# Altium project bga_fast_v2.0.PrjPcb (part 1 of 2)
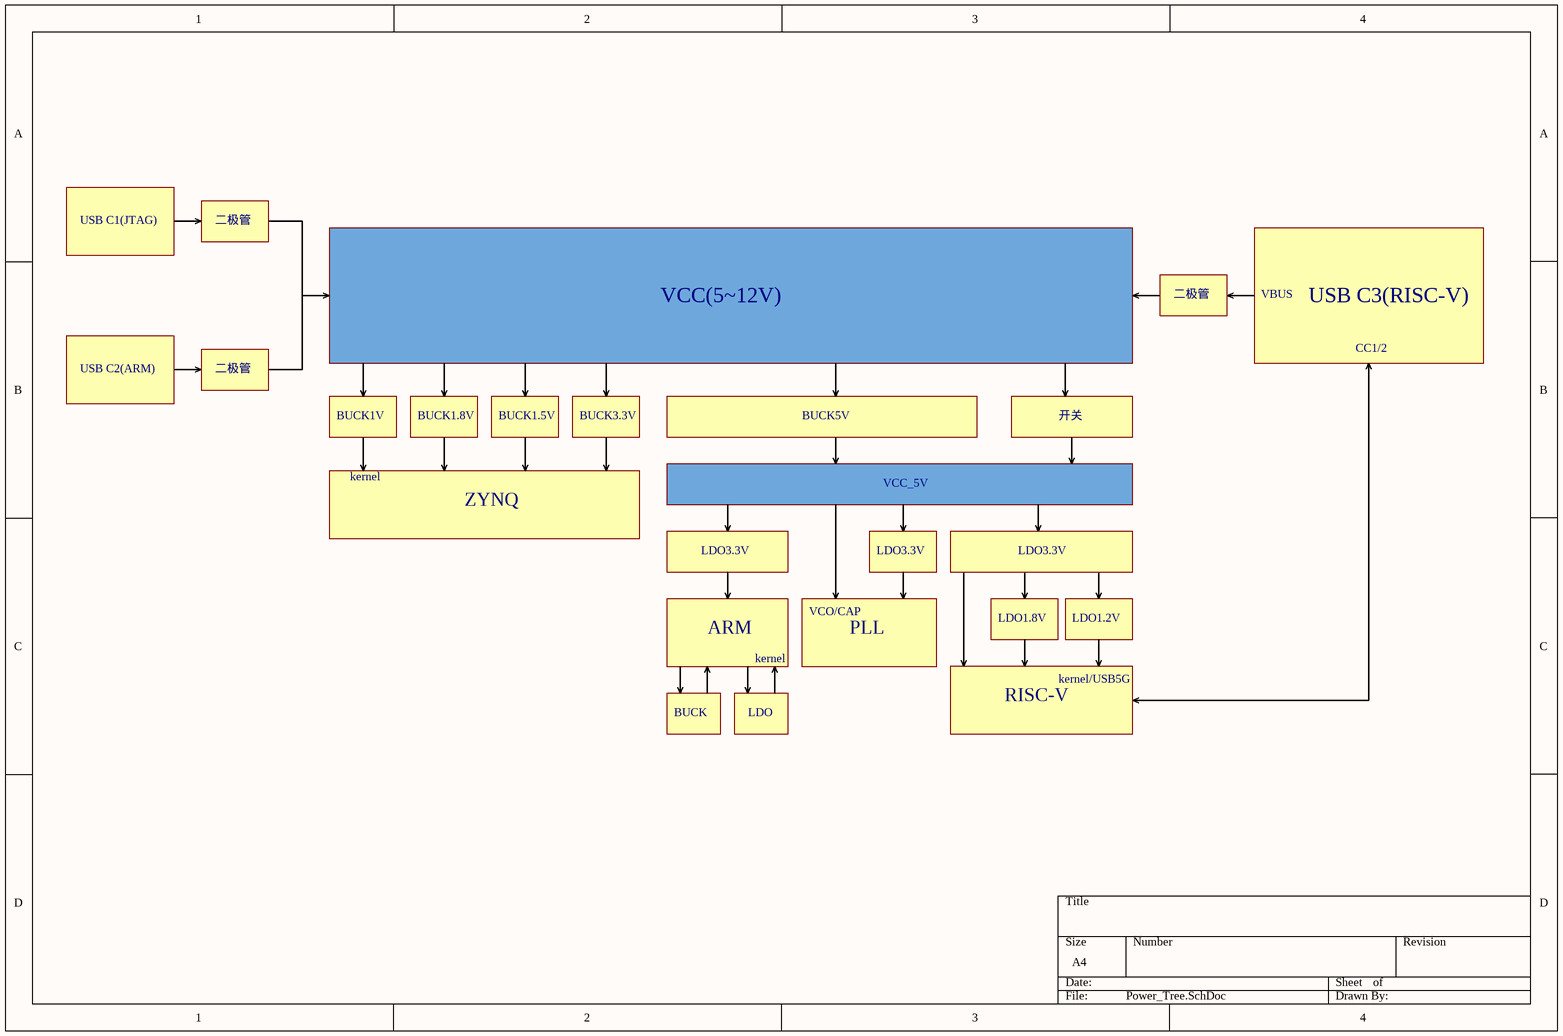
[diagram p0: Power_Tree.SchDoc]
7 sheets, 369 parts. Net scope: global (net labels, ports and power ports of the same name join across sheets).
Board file: BGA_faser_v2.PcbDoc
Sheets:
  Power_Tree.SchDoc
  Cortex_M.SchDoc
  ZYNQ.SchDoc
  jtag.SchDoc
  power.SchDoc
  Risc_V.SchDoc
  AD9156.SchDoc

## Sheet Power_Tree.SchDoc
size A4; SheetNumber: 1; SheetTotal: 7

### Notes on the sheet
- USB C1(JTAG)
- 二极管
- VCC(5~12V)
- VBUS
- USB C3(RISC-V)
- USB C2(ARM)
- CC1/2
- BUCK1V
- BUCK1.8V
- BUCK1.5V
- BUCK3.3V
- BUCK5V
- 开关
- kernel
- ZYNQ
- VCC_5V
- LDO3.3V
- ARM
- VCO/CAP
- PLL
- LDO1.8V
- LDO1.2V
- BUCK
- LDO
- RISC-V
- kernel/USB5G

## Sheet Cortex_M.SchDoc
size A4; SheetNumber: 2; SheetTotal: 7
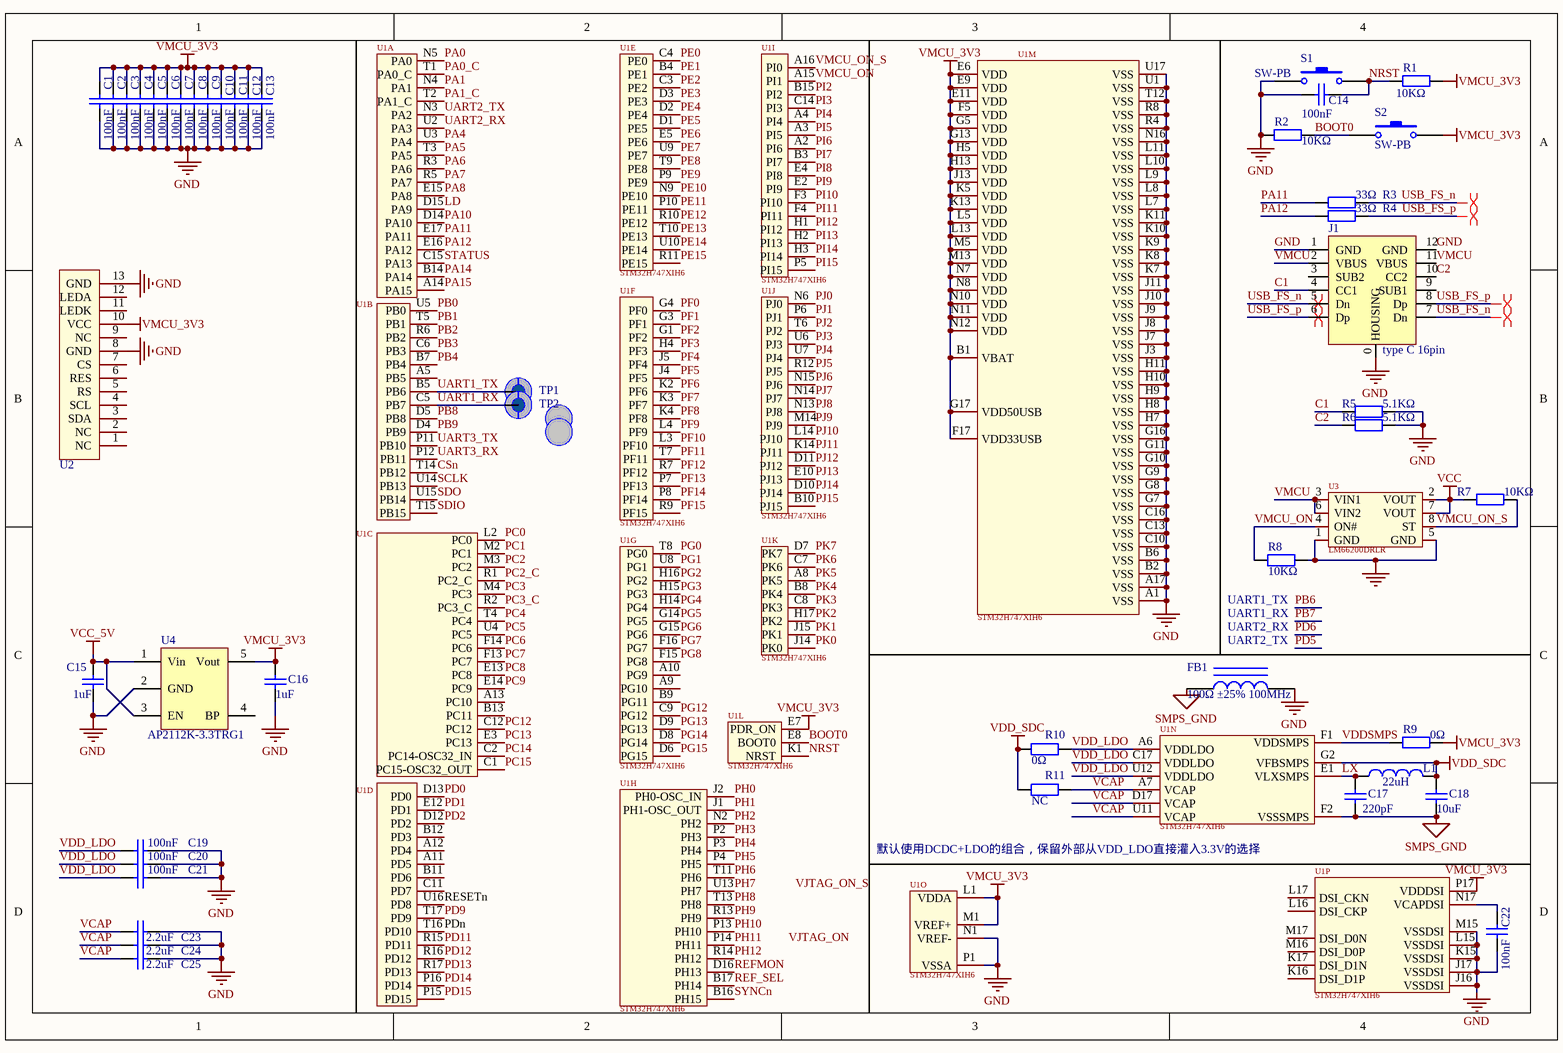
[diagram p1: Cortex_M.SchDoc]

### Parts
(Parts that share a designator on the sheet are numbered #1, #2 ... from top to bottom, then left to right.)
C1  100nF  [0201]
C2  100nF  [0201]
C3  100nF  [0201]
C4  100nF  [0201]
C5  100nF  [0201]
C6  100nF  [0201]
C7  100nF  [0201]
C8  100nF  [0201]
C9  100nF  [0201]
C10  100nF  [0201]
C11  100nF  [0201]
C12  100nF  [0201]
C13  100nF  [0201]
C14  100nF  [0805_C]
C15  1uF  [0805_C]
C16  1uF  [0805_C]
C17  220pF  [0805_C]
C18  10uF  [0805_C]
C19  100nF  [0201]
C20  100nF  [0201]
C21  100nF  [0201]
C22  100nF  [0201]
C23  2.2uF  [0805_C]
C24  2.2uF  [0805_C]
C25  2.2uF  [0805_C]
FB1  100Ω ±25% 100MHz  [0805_L]
J1  type C 16pin  [USB type C  16pin]
L1  value 22uH  [IND-SMD_L2.5-W2.0_YXMBL252010P]  (hidden comment: Inductor)
R1  10KΩ  [0805_R]
R2  10KΩ  [0805_R]
R3  33Ω  [0402_R]
R4  33Ω  [0402_R]
R5  5.1KΩ  [0805_R]
R6  5.1KΩ  [0805_R]
R7  10KΩ  [0805_R]
R8  10KΩ  [0805_R]
R9  0Ω  [0402_R]
R10  0Ω  [0402_R]
R11  NC  [0402_R]
S1  SW-PB  [SW-3*4-2P]
S2  SW-PB  [SW-3*4-2P]
TP1  test-point  [POINT]  (value not drawn)
TP2  test-point  [POINT]  (value not drawn)
U1#1  STM32H747XIH6  [TFBGA-265_L14.0-W14.0-P0.80-TL_STM32H743XIH6]  (value not drawn)  (parts A,B,C,D,E,F,G,H,I,J,K of 13)
U1#2  STM32H747XIH6  [TFBGA-265_L14.0-W14.0-P0.80-TL_STM32H743XIH6]  (parts L,M,N,O,P of 16)
U2  ZJY_1.14  [ZJY_1.14'']  (value not drawn)
U3  LM66200DRLR  [SOT-583-8_L2.1-W1.2-P0.50-LS1.6-BL]
U4  AP2112K-3.3TRG1  [SOT-23-5]

### Nets
GND: C1.1 C2.1 C3.1 C4.1 C5.1 C6.1 C7.1 C8.1 C9.1 C10.1 C11.1 C12.1 C13.1 C14.1 C15.1 C16.1 C19.2 C20.2 C21.2 C22.1 C23.2 C24.2 C25.2 FB1.2 J1.0(HOUSING) J1.1(GND) J1.12(GND) R2.1 R5.2 R6.2 R8.1 S1.1 U1#2.A1(VSS) U1#2.A17(VSS) U1#2.B2(VSS) U1#2.B6(VSS) U1#2.C10(VSS) U1#2.C13(VSS) U1#2.C16(VSS) U1#2.G7(VSS) U1#2.G8(VSS) U1#2.G9(VSS) U1#2.G10(VSS) U1#2.G11(VSS) U1#2.G16(VSS) U1#2.H7(VSS) U1#2.H8(VSS) U1#2.H9(VSS) U1#2.H10(VSS) U1#2.H11(VSS) U1#2.J3(VSS) U1#2.J7(VSS) U1#2.J8(VSS) U1#2.J9(VSS) U1#2.J10(VSS) U1#2.J11(VSS) U1#2.J16(VSSDSI) U1#2.J17(VSSDSI) U1#2.K7(VSS) U1#2.K8(VSS) U1#2.K9(VSS) U1#2.K10(VSS) U1#2.K11(VSS) U1#2.K15(VSSDSI) U1#2.L7(VSS) U1#2.L8(VSS) U1#2.L9(VSS) U1#2.L10(VSS) U1#2.L11(VSS) U1#2.L15(VSSDSI) U1#2.M15(VSSDSI) U1#2.N1(VREF-) U1#2.N16(VSS) U1#2.P1(VSSA) U1#2.R4(VSS) U1#2.R8(VSS) U1#2.T12(VSS) U1#2.U1(VSS) U1#2.U17(VSS) U2.8(GND) U2.13(GND) U3.1(GND) U3.5(GND) U4.2(GND)
SMPS_GND: C17.1 C18.1 FB1.1 U1#2.F2(VSSSMPS)
VCC: R7.1 U3.2(VOUT) U3.7(VOUT)
VCC_5V: C15.2 U4.1(Vin) U4.3(EN)
VDD_SDC: C18.2 L1.2 R10.2 R11.2 U1#2.G2(VFBSMPS)
VMCU_3V3: C1.2 C2.2 C3.2 C4.2 C5.2 C6.2 C7.2 C8.2 C9.2 C10.2 C11.2 C12.2 C13.2 C16.2 R1.2 R9.1 S2.2 U1#2.B1(VBAT) U1#2.E6(VDD) U1#2.E7(PDR_ON) U1#2.E9(VDD) U1#2.E11(VDD) U1#2.F5(VDD) U1#2.F17(VDD33USB) U1#2.G5(VDD) U1#2.G13(VDD) U1#2.G17(VDD50USB) U1#2.H5(VDD) U1#2.H13(VDD) U1#2.J13(VDD) U1#2.K5(VDD) U1#2.K13(VDD) U1#2.L1(VDDA) U1#2.L5(VDD) U1#2.L13(VDD) U1#2.M1(VREF+) U1#2.M5(VDD) U1#2.M13(VDD) U1#2.N7(VDD) U1#2.N8(VDD) U1#2.N10(VDD) U1#2.N11(VDD) U1#2.N12(VDD) U1#2.P17(VDDDSI) U2.10(VCC) U4.5(Vout)
BOOT0: R2.2 S2.1 U1#2.E8(BOOT0)
C1: J1.4(CC1) R5.1
C2: J1.10(CC2) R6.1
CSn: U1#1.T14(PB12)
LD: U1#1.D15(PA9)
LX: C17.2 L1.1 U1#2.E1(VLXSMPS)
NRST: C14.2 R1.1 S1.2 U1#2.K1(NRST)
PA0: U1#1.N5(PA0)
PA0_C: U1#1.T1(PA0_C)
PA1: U1#1.N4(PA1)
PA1_C: U1#1.T2(PA1_C)
PA4: U1#1.U3(PA4)
PA5: U1#1.T3(PA5)
PA6: U1#1.R3(PA6)
PA7: U1#1.R5(PA7)
PA8: U1#1.E15(PA8)
PA10: U1#1.D14(PA10)
PA11: R3.1 U1#1.E17(PA11)
PA12: R4.1 U1#1.E16(PA12)
PA14: U1#1.B14(PA14)
PA15: U1#1.A14(PA15)
PB0: U1#1.U5(PB0)
PB1: U1#1.T5(PB1)
PB2: U1#1.R6(PB2)
PB3: U1#1.C6(PB3)
PB4: U1#1.B7(PB4)
PB8: U1#1.D5(PB8)
PB9: U1#1.D4(PB9)
PC0: U1#1.L2(PC0)
PC1: U1#1.M2(PC1)
PC2: U1#1.M3(PC2)
PC2_C: U1#1.R1(PC2_C)
PC3: U1#1.M4(PC3)
PC3_C: U1#1.R2(PC3_C)
PC4: U1#1.T4(PC4)
PC5: U1#1.U4(PC5)
PC6: U1#1.F14(PC6)
PC7: U1#1.F13(PC7)
PC8: U1#1.E13(PC8)
PC9: U1#1.E14(PC9)
PC12: U1#1.C12(PC12)
PC13: U1#1.E3(PC13)
PC14: U1#1.C2(PC14-OSC32_IN)
PC15: U1#1.C1(PC15-OSC32_OUT)
PD0: U1#1.D13(PD0)
PD1: U1#1.E12(PD1)
PD2: U1#1.D12(PD2)
PD9: U1#1.T17(PD9)
PD11: U1#1.R15(PD11)
PD12: U1#1.R16(PD12)
PD13: U1#1.R17(PD13)
PD14: U1#1.P16(PD14)
PD15: U1#1.P15(PD15)
PDn: U1#1.T16(PD10)
PE0: U1#1.C4(PE0)
PE1: U1#1.B4(PE1)
PE2: U1#1.C3(PE2)
PE3: U1#1.D3(PE3)
PE4: U1#1.D2(PE4)
PE5: U1#1.D1(PE5)
PE6: U1#1.E5(PE6)
PE7: U1#1.U9(PE7)
PE8: U1#1.T9(PE8)
PE9: U1#1.P9(PE9)
PE10: U1#1.N9(PE10)
PE11: U1#1.P10(PE11)
PE12: U1#1.R10(PE12)
PE13: U1#1.T10(PE13)
PE14: U1#1.U10(PE14)
PE15: U1#1.R11(PE15)
PF0: U1#1.G4(PF0)
PF1: U1#1.G3(PF1)
PF2: U1#1.G1(PF2)
PF3: U1#1.H4(PF3)
PF4: U1#1.J5(PF4)
PF5: U1#1.J4(PF5)
PF6: U1#1.K2(PF6)
PF7: U1#1.K3(PF7)
PF8: U1#1.K4(PF8)
PF9: U1#1.L4(PF9)
PF10: U1#1.L3(PF10)
PF11: U1#1.T7(PF11)
PF12: U1#1.R7(PF12)
PF13: U1#1.P7(PF13)
PF14: U1#1.P8(PF14)
PF15: U1#1.R9(PF15)
PG0: U1#1.T8(PG0)
PG1: U1#1.U8(PG1)
PG2: U1#1.H16(PG2)
PG3: U1#1.H15(PG3)
PG4: U1#1.H14(PG4)
PG5: U1#1.G14(PG5)
PG6: U1#1.G15(PG6)
PG7: U1#1.F16(PG7)
PG8: U1#1.F15(PG8)
PG12: U1#1.C9(PG12)
PG13: U1#1.D9(PG13)
PG14: U1#1.D8(PG14)
PG15: U1#1.D6(PG15)
PH0: U1#1.J2(PH0-OSC_IN)
PH1: U1#1.J1(PH1-OSC_OUT)
PH2: U1#1.N2(PH2)
PH3: U1#1.P2(PH3)
PH4: U1#1.P3(PH4)
PH5: U1#1.P4(PH5)
PH6: U1#1.T11(PH6)
PH7: U1#1.U13(PH7)
PH8: U1#1.T13(PH8)
PH9: U1#1.R13(PH9)
PH10: U1#1.P13(PH10)
PH11: U1#1.P14(PH11)
PH12: U1#1.R14(PH12)
PI2: U1#1.B15(PI2)
PI3: U1#1.C14(PI3)
PI4: U1#1.A4(PI4)
PI5: U1#1.A3(PI5)
PI6: U1#1.A2(PI6)
PI7: U1#1.B3(PI7)
PI8: U1#1.E4(PI8)
PI9: U1#1.E2(PI9)
PI10: U1#1.F3(PI10)
PI11: U1#1.F4(PI11)
PI12: U1#1.H1(PI12)
PI13: U1#1.H2(PI13)
PI14: U1#1.H3(PI14)
PI15: U1#1.P5(PI15)
PJ0: U1#1.N6(PJ0)
PJ1: U1#1.P6(PJ1)
PJ2: U1#1.T6(PJ2)
PJ3: U1#1.U6(PJ3)
PJ4: U1#1.U7(PJ4)
PJ5: U1#1.R12(PJ5)
PJ6: U1#1.N15(PJ6)
PJ7: U1#1.N14(PJ7)
PJ8: U1#1.N13(PJ8)
PJ9: U1#1.M14(PJ9)
PJ10: U1#1.L14(PJ10)
PJ11: U1#1.K14(PJ11)
PJ12: U1#1.D11(PJ12)
PJ13: U1#1.E10(PJ13)
PJ14: U1#1.D10(PJ14)
PJ15: U1#1.B10(PJ15)
PK0: U1#1.J14(PK0)
PK1: U1#1.J15(PK1)
PK2: U1#1.H17(PK2)
PK3: U1#1.C8(PK3)
PK4: U1#1.B8(PK4)
PK5: U1#1.A8(PK5)
PK6: U1#1.C7(PK6)
PK7: U1#1.D7(PK7)
REF_SEL: U1#1.B17(PH14)
REFMON: U1#1.D16(PH13)
RESETn: U1#1.U16(PD8)
SCLK: U1#1.U14(PB13)
SDIO: U1#1.T15(PB15)
SDO: U1#1.U15(PB14)
STATUS: U1#1.C15(PA13)
SYNCn: U1#1.B16(PH15)
UART1_RX: TP2.1(point) U1#1.C5(PB7)
UART1_TX: TP1.1(point) U1#1.B5(PB6)
UART2_RX: U1#1.U2(PA3)  [project net U8_TX]
UART2_TX: U1#1.N3(PA2)  [project net U8_RX]
UART3_RX: U1#1.P12(PB11)  [project net U5_TX]
UART3_TX: U1#1.P11(PB10)  [project net U5_RX]
USB_FS_n: J1.5(Dn) J1.7(Dn) R3.2
USB_FS_p: J1.6(Dp) J1.8(Dp) R4.2
VCAP: C23.1 C24.1 C25.1 R11.1 U1#2.A7(VCAP) U1#2.D17(VCAP) U1#2.U11(VCAP)
VDD_LDO: C19.1 C20.1 C21.1 R10.1 U1#2.A6(VDDLDO) U1#2.C17(VDDLDO) U1#2.U12(VDDLDO)
VDDSMPS: R9.2 U1#2.F1(VDDSMPS)
VMCU: J1.2(VBUS) J1.11(VBUS) U3.3(VIN1) U3.6(VIN2)
VMCU_ON: R8.2 U1#1.A15(PI1) U3.4(ON#)
VMCU_ON_S: R7.2 U1#1.A16(PI0) U3.8(ST)
NetC22_2: C22.2 U1#2.N17(VCAPDSI)

Not connected (* = marked no-connect by the designer): J1 3(SUB2) 9(SUB1); U1#1 A5(PB5) A9(PG10) A10(PG9) A11(PD5) A12(PD4) A13(PC10) B9(PG11) B11(PD6) B12(PD3) B13(PC11) C11(PD7); U1#2 K16(DSI_D1P) K17(DSI_D1N) L16(DSI_CKP) L17(DSI_CKN) M16(DSI_D0P) M17(DSI_D0N); U2 1(NC) 2(NC) 3(SDA) 4(SCL) 5(RS) 6(RES) 7(CS) 9(NC) 11(LEDK) 12(LEDA); U4 4(BP)

### Layout directives
differential pair: USB_FS_n, USB_FS_p

### Notes on the sheet
- (near R8) UART1_TX
- UART1_RX
- (near FB1) UART2_TX
- UART2_RX
- (near U1#2) 默认使用DCDC+LDO的组合，保留外部从VDD_LDO直接灌入3.3V的选择
- Labels drawn without touching a wire or pin: VJTAG_ON, VJTAG_ON_S

### Library data of the parts
C1-C14 C19-C22 = 0402 100nF (104) 10% 16V: 贴片电容; ComponentLink1Description: 供应商链接; ComponentLink1URL: http://www.szlcsc.com/product/details_1877.html; Package: 0402; Supplier: LC; SuppliersPartNumber: C1525
C15 C16 = 0805 1uF (105) 10% 50V: 贴片电容; ComponentLink1Description: 供应商链接; ComponentLink1URL: http://www.szlcsc.com/product/details_29074.html; Package: 0805; Supplier: LC; SuppliersPartNumber: C28323
C17 = 0402 220pF (221) 10% 50V: 贴片电容; ComponentLink1Description: 供应商链接; ComponentLink1URL: http://www.szlcsc.com/product/details_1882.html; Package: 0402; Supplier: LC; SuppliersPartNumber: C1530
C18 = 0603 10uF (106) 10% 10V: 贴片电容; ComponentLink1Description: 供应商链接; ComponentLink1URL: http://www.szlcsc.com/product/details_20411.html; Package: 0603; Supplier: LC; SuppliersPartNumber: C19702
C23-C25 = 0402 1.0uF (105) 10% 25V: 贴片电容; ComponentLink1Description: 供应商链接; ComponentLink1URL: http://www.szlcsc.com/product/details_53938.html; Package: 0402; Supplier: LC; SuppliersPartNumber: C52923
FB1 = 0805 100Ω 25% 100MHz: 贴片磁珠; ComponentLink1Description: 供应商链接; ComponentLink1URL: http://www.szlcsc.com/product/details_1367.html; Package: 0805; Supplier: LC; SuppliersPartNumber: C1015
J1 = USB type C 16pin: 16针脚C口
L1 = Inductor: Code_IEC: 1005; Published: 8-Jun-2000; LatestRevisionDate: 29-May-2009; LatestRevisionNote: IPC-7351 Footprint Added.; PackageReference: 0402-A; Publisher: Altium Limited; PackageDescription: Chip Inductor; Code_JEITA: 0402
R1 R2 = 0402 10KΩ (1002) 1%: 贴片电阻; ComponentLink1Description: 供应商链接; ComponentLink1URL: http://www.szlcsc.com/product/details_26487.html; Package: 0402; Supplier: LC; SuppliersPartNumber: C25744
R3 R4 = 0402 33Ω (33R0) 1%: 贴片电阻; ComponentLink1Description: 供应商链接; ComponentLink1URL: http://www.szlcsc.com/product/details_25848.html; Package: 0402; Supplier: LC; SuppliersPartNumber: C25105
R5 R6 = 0402 5.1KΩ (5101) 1%: 贴片电阻; ComponentLink1Description: 供应商链接; ComponentLink1URL: http://www.szlcsc.com/product/details_26648.html; Package: 0402; Supplier: LC; SuppliersPartNumber: C25905
R7 R8 = 0805 10KΩ (1002) 1%: 贴片电阻; ComponentLink1Description: 供应商链接; ComponentLink1URL: http://www.szlcsc.com/product/details_18102.html; Package: 0805; Supplier: LC; SuppliersPartNumber: C17414
R9-R11 = 0402 0Ω (0R0) 1%: 贴片电阻; ComponentLink1Description: 供应商链接; ComponentLink1URL: http://www.szlcsc.com/product/details_17853.html; Package: 0402; Supplier: LC; SuppliersPartNumber: C17168
S1 S2 = SW-PB: Switch; Published: 24-Mar-1999; LatestRevisionDate: 17-Jul-2002; LatestRevisionNote: Re-released for DXP Platform.; PackageReference: SPST-2; Publisher: Altium Limited; PackageDescription: Switch; 2 Leads
TP1 TP2 = test-point: 测试点
U1#1 U1#2 = STM32H747XIH6: 双核MCU; Manufacturer: ST(意法半导体); Add into BOM: yes; Symbol: STM32H747XIH6; Device: STM32H747XIH6; LCSC Part Name: 带DSP和DP-FPU的高性能ARM Cortex-M7 + Cortex-M4 MCU，具有2 MB Flash、1 MB RAM、480 MHz CPU、ART加速器、一级缓存、外部存储器接口、大量外设、SMPS和MIPI-DSI; Supplier Part: C5271089; Manufacturer Part: STM32H747XIH6; Supplier Footprint: TFBGA-265(14x14); JLCPCB Part Class: Extended Part; Datasheet: https://atta.szlcsc.com/upload/public/pdf/source/20230906/B22899485390F262A37AA3B845B2D1AE.pdf; Supplier: LCSC; Convert to PCB: yes
U2 = ZJY_1.14: Convert to PCB: yes; Symbol: ZJY_1.14''; Device: ZJY_1.14; Add into BOM: yes
U3 = LM66200DRLR: 理想二极管; Manufacturer: TI(德州仪器); Add into BOM: yes; Symbol: LM66200DRLR; Device: LM66200DRLR; LCSC Part Name: LM66200DRLR; Supplier Part: C3235556; Manufacturer Part: LM66200DRLR; Supplier Footprint: SOT-583; JLCPCB Part Class: Extended Part; Datasheet: https://www.ti.com/cn/lit/gpn/lm66200; Supplier: LCSC; Convert to PCB: yes
U4 = RT9193-33: 3.3v低压差稳压芯片

## Sheet ZYNQ.SchDoc
size A2; SheetNumber: 3; SheetTotal: 7; SPICEModelCacheBIOPMTWN: <root> / <DocumentId>BIOPMTWN</DocumentId> / <CacheFrame Number="0"> / <Model Name="dpsw2" Kind="CKT"> / <Text>* DIP switch 2 / * jjt 19/6/2002: created / * / *             Switch connections: / *             sw1 / *             |  |  sw2 / *             |  |  |  | / *             |  |  |  | / .subckt dpsw2 1  2  4  5 / + PARAMS: STATE1=0 STATE2=0 RON=1m ROFF=100E6 / * / V1 3 0 {STATE1} / V2 6 0 {STATE2} / * / SDIP1 1 2 3 0 DIPMOD / SDIP2 4 5 6 0 DIPMOD / * / .MODEL DIPMOD SW(VT=0.5 RON={RON} ROFF={ROFF}) / .ends dpsw2</Text> / </Model> / </CacheFrame> / </root>
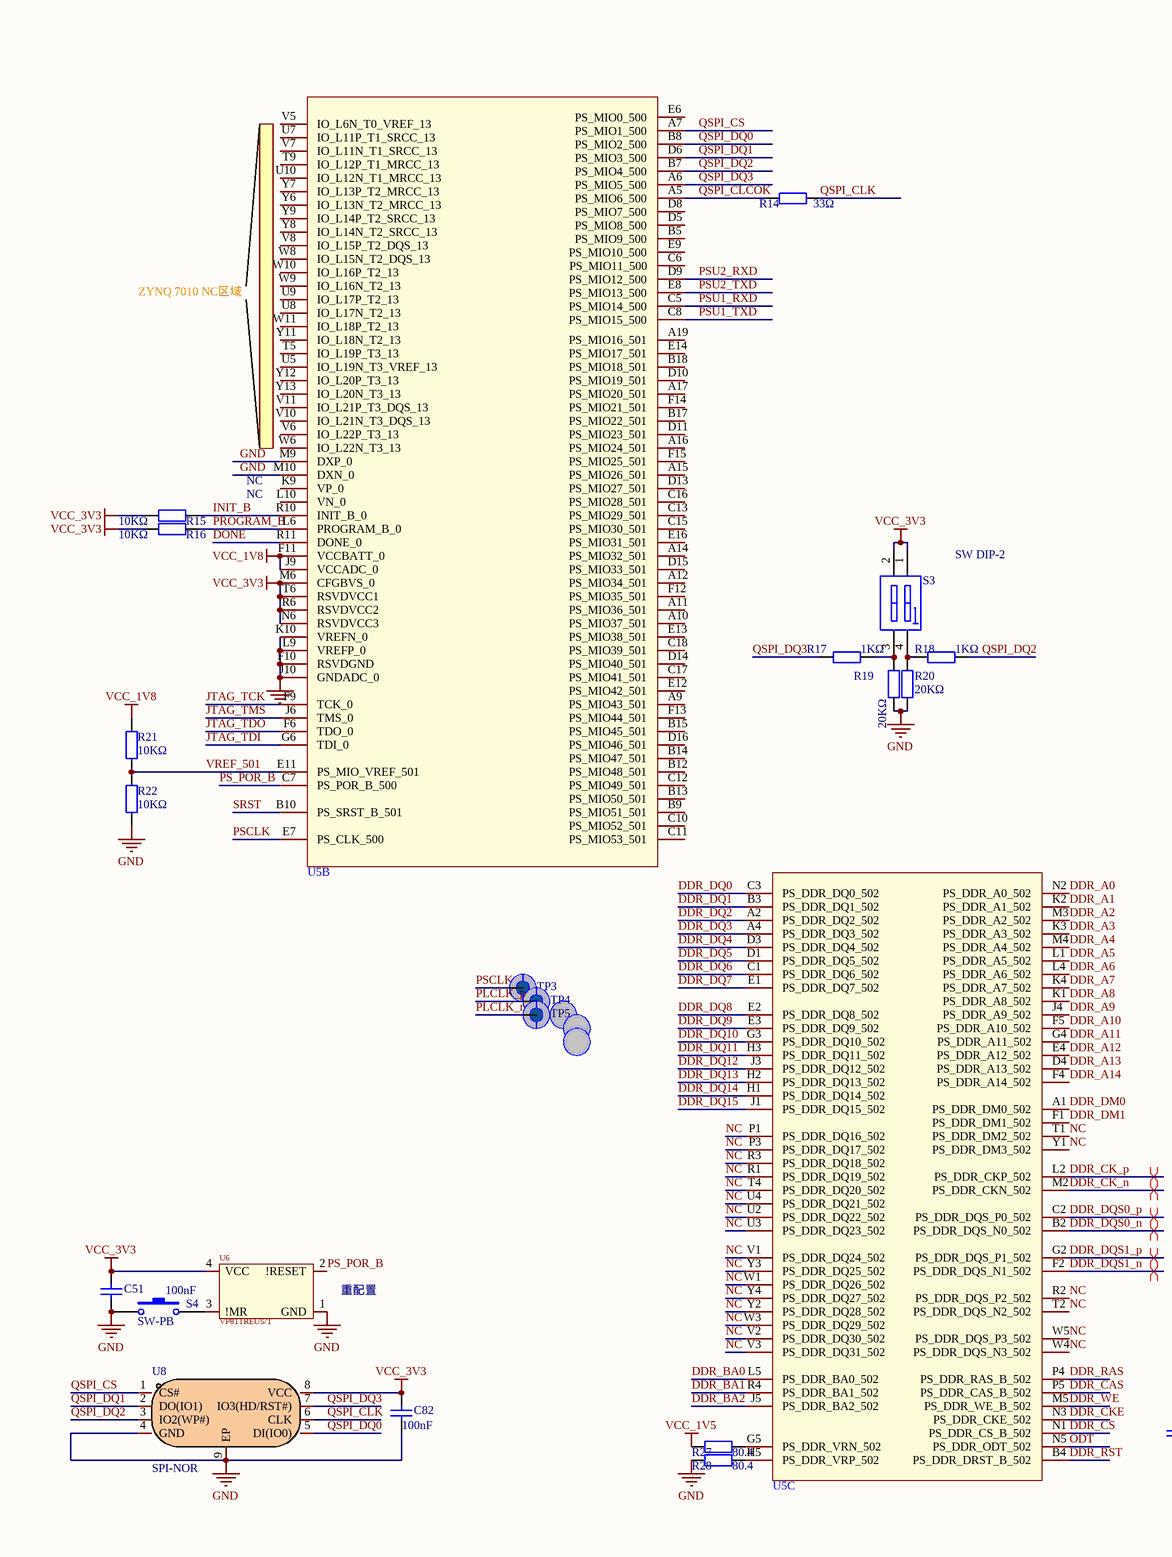
[diagram p2: ZYNQ.SchDoc, left]
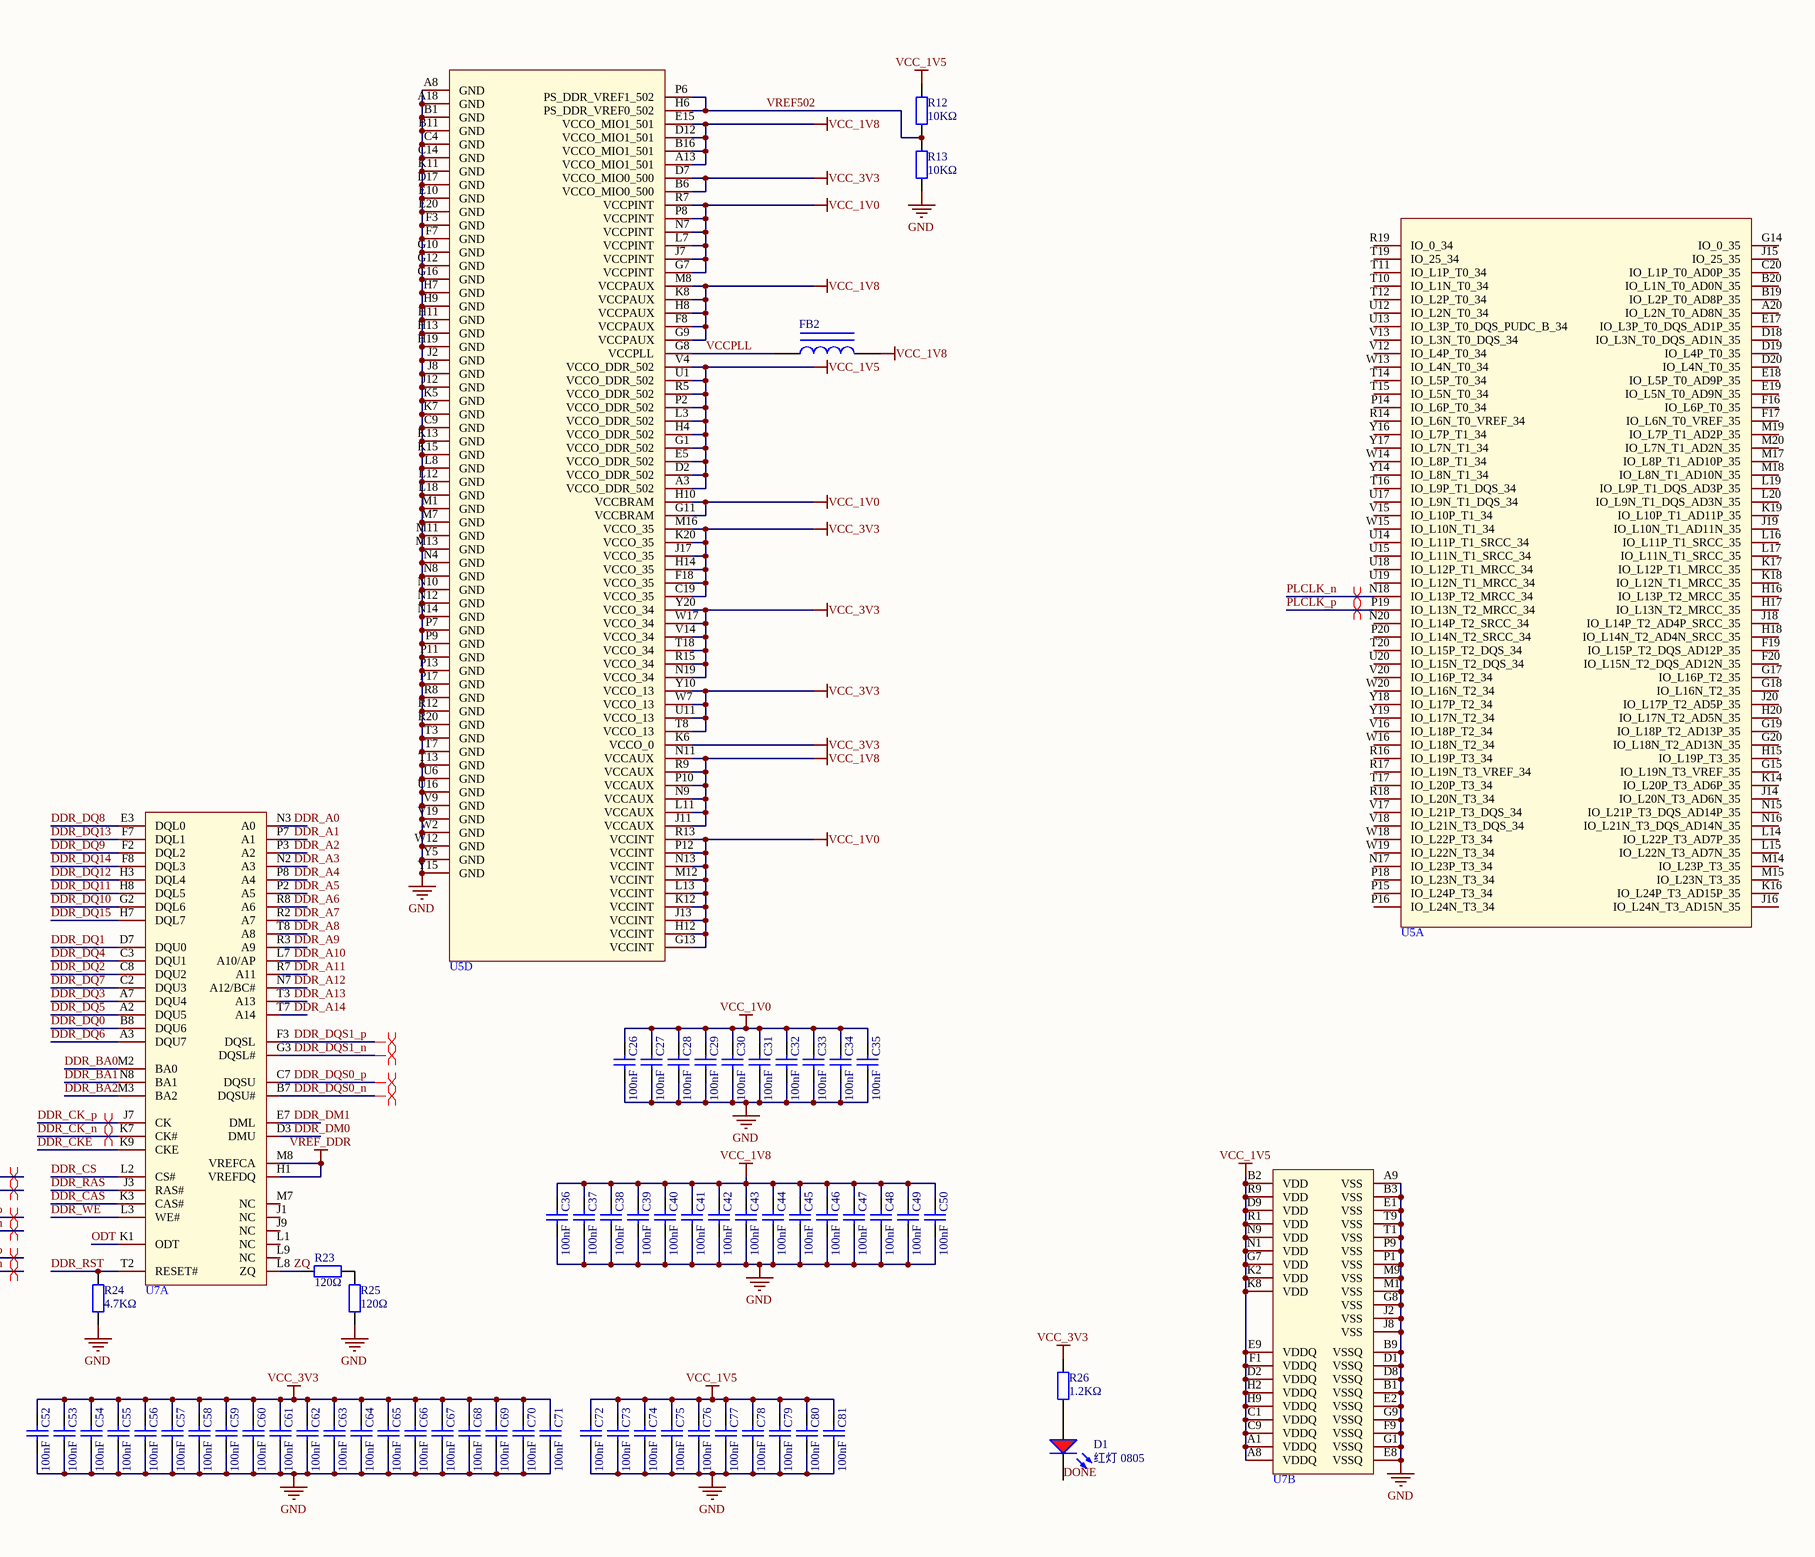
[diagram p3: ZYNQ.SchDoc, right]

### Parts
C26  100nF  [0201]
C27  100nF  [0201]
C28  100nF  [0201]
C29  100nF  [0201]
C30  100nF  [0201]
C31  100nF  [0201]
C32  100nF  [0201]
C33  100nF  [0201]
C34  100nF  [0201]
C35  100nF  [0201]
C36  100nF  [0201]
C37  100nF  [0201]
C38  100nF  [0201]
C39  100nF  [0201]
C40  100nF  [0201]
C41  100nF  [0201]
C42  100nF  [0201]
C43  100nF  [0201]
C44  100nF  [0201]
C45  100nF  [0201]
C46  100nF  [0201]
C47  100nF  [0201]
C48  100nF  [0201]
C49  100nF  [0201]
C50  100nF  [0201]
C51  100nF  [0805_C]
C52  100nF  [0201]
C53  100nF  [0201]
C54  100nF  [0201]
C55  100nF  [0201]
C56  100nF  [0201]
C57  100nF  [0201]
C58  100nF  [0201]
C59  100nF  [0201]
C60  100nF  [0201]
C61  100nF  [0201]
C62  100nF  [0201]
C63  100nF  [0201]
C64  100nF  [0201]
C65  100nF  [0201]
C66  100nF  [0201]
C67  100nF  [0201]
C68  100nF  [0201]
C69  100nF  [0201]
C70  100nF  [0201]
C71  100nF  [0201]
C72  100nF  [0201]
C73  100nF  [0201]
C74  100nF  [0201]
C75  100nF  [0201]
C76  100nF  [0201]
C77  100nF  [0201]
C78  100nF  [0201]
C79  100nF  [0201]
C80  100nF  [0201]
C81  100nF  [0201]
C82  100nF  [0805_C]
D1  红灯 0805  [0805_LED_S1]
FB2  100Ω ±25% 100MHz  [0805_L]  (value not drawn)
R12  10KΩ  [0201]
R13  10KΩ  [0201]
R14  33Ω  [0805_R]
R15  10KΩ  [0201]
R16  10KΩ  [0201]
R17  1KΩ  [0805_R]
R18  1KΩ  [0805_R]
R19  20KΩ  [0805_R]
R20  20KΩ  [0805_R]
R21  10KΩ  [0201]
R22  10KΩ  [0201]
R23  120Ω  [0805_R]
R24  4.7KΩ  [0805_R]
R25  120Ω  [0805_R]
R26  1.2KΩ  [0805_R]
R27  80.4  [0402_R]
R28  80.4  [0402_R]
S3  SW DIP-2  [SW-SMD_DSHP02TS-S]
S4  SW-PB  [SW-3*4-2P]
TP3  test-point  [POINT]  (value not drawn)
TP4  test-point  [POINT]  (value not drawn)
TP5  test-point  [POINT]  (value not drawn)
U5  XC7Z020-2CLG400I  [FBGA-400_L17.0-W17.0-R20-C20-P0.80-TL]  (value not drawn)  (parts A,B,C,D of 4)
U6  VP811REUS/T  [SOT-143_L2.9-W1.3-P1.92-LS2.3-BL]
U7  NT5CC256M16ER-EK  [TFBGA-96_L13.0-W8.0-R16-C6-P0.80-TL]  (value not drawn)  (parts A,B of 2)
U8  SPI-NOR  [WSON8]

### Nets
GND: C26.1 C27.1 C28.1 C29.1 C30.1 C31.1 C32.1 C33.1 C34.1 C35.1 C36.1 C37.1 C38.1 C39.1 C40.1 C41.1 C42.1 C43.1 C44.1 C45.1 C46.1 C47.1 C48.1 C49.1 C50.1 C51.1 C52.1 C53.1 C54.1 C55.1 C56.1 C57.1 C58.1 C59.1 C60.1 C61.1 C62.1 C63.1 C64.1 C65.1 C66.1 C67.1 C68.1 C69.1 C70.1 C71.1 C72.1 C73.1 C74.1 C75.1 C76.1 C77.1 C78.1 C79.1 C80.1 C81.1 C82.1 R13.1 R19.1 R20.1 R22.1 R24.1 R25.1 R28.1 S4.1 U5.A8(GND) U5.A18(GND) U5.B1(GND) U5.B11(GND) U5.C4(GND) U5.C9(GND) U5.C14(GND) U5.D17(GND) U5.E10(GND) U5.E20(GND) U5.F3(GND) U5.F7(GND) U5.F10(RSVDGND) U5.G10(GND) U5.G12(GND) U5.G16(GND) U5.H7(GND) U5.H9(GND) U5.H11(GND) U5.H13(GND) U5.H19(GND) U5.J2(GND) U5.J8(GND) U5.J10(GNDADC_0) U5.J12(GND) U5.K5(GND) U5.K7(GND) U5.K10(VREFN_0) U5.K11(GND) U5.K13(GND) U5.K15(GND) U5.L8(GND) U5.L9(VREFP_0) U5.L12(GND) U5.L18(GND) U5.M1(GND) U5.M7(GND) U5.M9(DXP_0) U5.M10(DXN_0) U5.M11(GND) U5.M13(GND) U5.N4(GND) U5.N8(GND) U5.N10(GND) U5.N12(GND) U5.N14(GND) U5.P7(GND) U5.P9(GND) U5.P11(GND) U5.P13(GND) U5.P17(GND) U5.R8(GND) U5.R12(GND) U5.R20(GND) U5.T3(GND) U5.T7(GND) U5.T13(GND) U5.U6(GND) U5.U16(GND) U5.V9(GND) U5.V19(GND) U5.W2(GND) U5.W12(GND) U5.Y5(GND) U5.Y15(GND) U6.1(GND) U7.A9(VSS) U7.B1(VSSQ) U7.B3(VSS) U7.B9(VSSQ) U7.D1(VSSQ) U7.D8(VSSQ) U7.E1(VSS) U7.E2(VSSQ) U7.E8(VSSQ) U7.F9(VSSQ) U7.G1(VSSQ) U7.G8(VSS) U7.G9(VSSQ) U7.J2(VSS) U7.J8(VSS) U7.M1(VSS) U7.M9(VSS) U7.P1(VSS) U7.P9(VSS) U7.T1(VSS) U7.T9(VSS) U8.4(GND) U8.9(EP)
VCC_1V0: C26.2 C27.2 C28.2 C29.2 C30.2 C31.2 C32.2 C33.2 C34.2 C35.2 U5.G7(VCCPINT) U5.G11(VCCBRAM) U5.G13(VCCINT) U5.H10(VCCBRAM) U5.H12(VCCINT) U5.J7(VCCPINT) U5.J13(VCCINT) U5.K12(VCCINT) U5.L7(VCCPINT) U5.L13(VCCINT) U5.M12(VCCINT) U5.N7(VCCPINT) U5.N13(VCCINT) U5.P8(VCCPINT) U5.P12(VCCINT) U5.R7(VCCPINT) U5.R13(VCCINT)
VCC_1V5: C72.2 C73.2 C74.2 C75.2 C76.2 C77.2 C78.2 C79.2 C80.2 C81.2 R12.2 R27.1 U5.A3(VCCO_DDR_502) U5.D2(VCCO_DDR_502) U5.E5(VCCO_DDR_502) U5.G1(VCCO_DDR_502) U5.H4(VCCO_DDR_502) U5.L3(VCCO_DDR_502) U5.P2(VCCO_DDR_502) U5.R5(VCCO_DDR_502) U5.U1(VCCO_DDR_502) U5.V4(VCCO_DDR_502) U7.A1(VDDQ) U7.A8(VDDQ) U7.B2(VDD) U7.C1(VDDQ) U7.C9(VDDQ) U7.D2(VDDQ) U7.D9(VDD) U7.E9(VDDQ) U7.F1(VDDQ) U7.G7(VDD) U7.H2(VDDQ) U7.H9(VDDQ) U7.K2(VDD) U7.K8(VDD) U7.N1(VDD) U7.N9(VDD) U7.R1(VDD) U7.R9(VDD)
VCC_1V8: C36.2 C37.2 C38.2 C39.2 C40.2 C41.2 C42.2 C43.2 C44.2 C45.2 C46.2 C47.2 C48.2 C49.2 C50.2 FB2.2 R21.2 U5.A13(VCCO_MIO1_501) U5.B16(VCCO_MIO1_501) U5.D12(VCCO_MIO1_501) U5.E15(VCCO_MIO1_501) U5.F8(VCCPAUX) U5.F11(VCCBATT_0) U5.G9(VCCPAUX) U5.H8(VCCPAUX) U5.J9(VCCADC_0) U5.J11(VCCAUX) U5.K8(VCCPAUX) U5.L11(VCCAUX) U5.M8(VCCPAUX) U5.N9(VCCAUX) U5.N11(VCCAUX) U5.P10(VCCAUX) U5.R9(VCCAUX)
VCC_3V3: C51.2 C52.2 C53.2 C54.2 C55.2 C56.2 C57.2 C58.2 C59.2 C60.2 C61.2 C62.2 C63.2 C64.2 C65.2 C66.2 C67.2 C68.2 C69.2 C70.2 C71.2 C82.2 R15.1 R16.1 R26.2 S3.1(A1) S3.2(A2) U5.B6(VCCO_MIO0_500) U5.C19(VCCO_35) U5.D7(VCCO_MIO0_500) U5.F18(VCCO_35) U5.H14(VCCO_35) U5.J17(VCCO_35) U5.K6(VCCO_0) U5.K20(VCCO_35) U5.M6(CFGBVS_0) U5.M16(VCCO_35) U5.N6(RSVDVCC3) U5.N19(VCCO_34) U5.R6(RSVDVCC2) U5.R15(VCCO_34) U5.T6(RSVDVCC1) U5.T8(VCCO_13) U5.T18(VCCO_34) U5.U11(VCCO_13) U5.V14(VCCO_34) U5.W7(VCCO_13) U5.W17(VCCO_34) U5.Y10(VCCO_13) U5.Y20(VCCO_34) U6.4(VCC) U8.8(VCC)
VREF_DDR: U7.H1(VREFDQ) U7.M8(VREFCA)
DDR_A0: U5.N2(PS_DDR_A0_502) U7.N3(A0)
DDR_A1: U5.K2(PS_DDR_A1_502) U7.P7(A1)
DDR_A2: U5.M3(PS_DDR_A2_502) U7.P3(A2)
DDR_A3: U5.K3(PS_DDR_A3_502) U7.N2(A3)
DDR_A4: U5.M4(PS_DDR_A4_502) U7.P8(A4)
DDR_A5: U5.L1(PS_DDR_A5_502) U7.P2(A5)
DDR_A6: U5.L4(PS_DDR_A6_502) U7.R8(A6)
DDR_A7: U5.K4(PS_DDR_A7_502) U7.R2(A7)
DDR_A8: U5.K1(PS_DDR_A8_502) U7.T8(A8)
DDR_A9: U5.J4(PS_DDR_A9_502) U7.R3(A9)
DDR_A10: U5.F5(PS_DDR_A10_502) U7.L7(A10/AP)
DDR_A11: U5.G4(PS_DDR_A11_502) U7.R7(A11)
DDR_A12: U5.E4(PS_DDR_A12_502) U7.N7(A12/BC#)
DDR_A13: U5.D4(PS_DDR_A13_502) U7.T3(A13)
DDR_A14: U5.F4(PS_DDR_A14_502) U7.T7(A14)
DDR_BA0: U5.L5(PS_DDR_BA0_502) U7.M2(BA0)
DDR_BA1: U5.R4(PS_DDR_BA1_502) U7.N8(BA1)
DDR_BA2: U5.J5(PS_DDR_BA2_502) U7.M3(BA2)
DDR_CAS: U5.P5(PS_DDR_CAS_B_502) U7.K3(CAS#)
DDR_CK_n: U5.M2(PS_DDR_CKN_502) U7.K7(CK#)
DDR_CK_p: U5.L2(PS_DDR_CKP_502) U7.J7(CK)
DDR_CKE: U5.N3(PS_DDR_CKE_502) U7.K9(CKE)
DDR_CS: U5.N1(PS_DDR_CS_B_502) U7.L2(CS#)
DDR_DM0: U5.A1(PS_DDR_DM0_502) U7.D3(DMU)
DDR_DM1: U5.F1(PS_DDR_DM1_502) U7.E7(DML)
DDR_DQ0: U5.C3(PS_DDR_DQ0_502) U7.B8(DQU6)
DDR_DQ1: U5.B3(PS_DDR_DQ1_502) U7.D7(DQU0)
DDR_DQ2: U5.A2(PS_DDR_DQ2_502) U7.C8(DQU2)
DDR_DQ3: U5.A4(PS_DDR_DQ3_502) U7.A7(DQU4)
DDR_DQ4: U5.D3(PS_DDR_DQ4_502) U7.C3(DQU1)
DDR_DQ5: U5.D1(PS_DDR_DQ5_502) U7.A2(DQU5)
DDR_DQ6: U5.C1(PS_DDR_DQ6_502) U7.A3(DQU7)
DDR_DQ7: U5.E1(PS_DDR_DQ7_502) U7.C2(DQU3)
DDR_DQ8: U5.E2(PS_DDR_DQ8_502) U7.E3(DQL0)
DDR_DQ9: U5.E3(PS_DDR_DQ9_502) U7.F2(DQL2)
DDR_DQ10: U5.G3(PS_DDR_DQ10_502) U7.G2(DQL6)
DDR_DQ11: U5.H3(PS_DDR_DQ11_502) U7.H8(DQL5)
DDR_DQ12: U5.J3(PS_DDR_DQ12_502) U7.H3(DQL4)
DDR_DQ13: U5.H2(PS_DDR_DQ13_502) U7.F7(DQL1)
DDR_DQ14: U5.H1(PS_DDR_DQ14_502) U7.F8(DQL3)
DDR_DQ15: U5.J1(PS_DDR_DQ15_502) U7.H7(DQL7)
DDR_DQS0_n: U5.B2(PS_DDR_DQS_N0_502) U7.B7(DQSU#)
DDR_DQS0_p: U5.C2(PS_DDR_DQS_P0_502) U7.C7(DQSU)
DDR_DQS1_n: U5.F2(PS_DDR_DQS_N1_502) U7.G3(DQSL#)
DDR_DQS1_p: U5.G2(PS_DDR_DQS_P1_502) U7.F3(DQSL)
DDR_RAS: U5.P4(PS_DDR_RAS_B_502) U7.J3(RAS#)
DDR_RST: R24.2 U5.B4(PS_DDR_DRST_B_502) U7.T2(RESET#)
DDR_WE: U5.M5(PS_DDR_WE_B_502) U7.L3(WE#)
DONE: D1.K U5.R11(DONE_0)
INIT_B: R15.2 U5.R10(INIT_B_0)
JTAG_TCK: U5.F9(TCK_0)
JTAG_TDI: U5.G6(TDI_0)
JTAG_TDO: U5.F6(TDO_0)
JTAG_TMS: U5.J6(TMS_0)
NC: U5.P1(PS_DDR_DQ16_502) U5.P3(PS_DDR_DQ17_502) U5.R1(PS_DDR_DQ19_502) U5.R2(PS_DDR_DQS_P2_502) U5.R3(PS_DDR_DQ18_502) U5.T1(PS_DDR_DM2_502) U5.T2(PS_DDR_DQS_N2_502) U5.T4(PS_DDR_DQ20_502) U5.U2(PS_DDR_DQ22_502) U5.U3(PS_DDR_DQ23_502) U5.U4(PS_DDR_DQ21_502) U5.V1(PS_DDR_DQ24_502) U5.V2(PS_DDR_DQ30_502) U5.V3(PS_DDR_DQ31_502) U5.W1(PS_DDR_DQ26_502) U5.W3(PS_DDR_DQ29_502) U5.W4(PS_DDR_DQS_N3_502) U5.W5(PS_DDR_DQS_P3_502) U5.Y1(PS_DDR_DM3_502) U5.Y2(PS_DDR_DQ28_502) U5.Y3(PS_DDR_DQ25_502) U5.Y4(PS_DDR_DQ27_502)
ODT: U5.N5(PS_DDR_ODT_502) U7.K1(ODT)
PLCLK_n: TP5.1(point) U5.N18(IO_L13P_T2_MRCC_34)
PLCLK_p: TP4.1(point) U5.P19(IO_L13N_T2_MRCC_34)
PROGRAM_B: R16.2 U5.L6(PROGRAM_B_0)
PS_POR_B: U5.C7(PS_POR_B_500) U6.2(!RESET)
PSCLK: TP3.1(point) U5.E7(PS_CLK_500)
PSU1_RXD: U5.C5(PS_MIO14_500)
PSU1_TXD: U5.C8(PS_MIO15_500)
PSU2_RXD: U5.D9(PS_MIO12_500)
PSU2_TXD: U5.E8(PS_MIO13_500)
QSPI_CLCOK: R14.1 U5.A5(PS_MIO6_500)
QSPI_CLK: R14.2 U8.6(CLK)
QSPI_CS: U5.A7(PS_MIO1_500) U8.1(CS#)
QSPI_DQ0: U5.B8(PS_MIO2_500) U8.5(DI(IO0))
QSPI_DQ1: U5.D6(PS_MIO3_500) U8.2(DO(IO1))
QSPI_DQ2: R18.2 U5.B7(PS_MIO4_500) U8.3(IO2(WP#))
QSPI_DQ3: R17.1 U5.A6(PS_MIO5_500) U8.7(IO3(HD/RST#))
SRST: U5.B10(PS_SRST_B_501)
VCCPLL: FB2.1 U5.G8(VCCPLL)
VREF502: R12.1 R13.2 U5.H6(PS_DDR_VREF0_502) U5.P6(PS_DDR_VREF1_502)
VREF_501: R21.1 R22.2 U5.E11(PS_MIO_VREF_501)
ZQ: R23.1 U7.L8(ZQ)
NetD1_A: D1.A R26.1
NetR17_2: R17.2 R19.2 S3.3(B2)
NetR18_1: R18.1 R20.2 S3.4(B1)
NetR23_2: R23.2 R25.2
NetR27_2: R27.2 U5.G5(PS_DDR_VRN_502)
NetR28_2: R28.2 U5.H5(PS_DDR_VRP_502)
NetS4_2: S4.2 U6.3(!MR)

Not connected (* = marked no-connect by the designer): U5 A9(PS_MIO43_501) A10(PS_MIO37_501) A11(PS_MIO36_501) A12(PS_MIO34_501) A14(PS_MIO32_501) A15(PS_MIO26_501) A16(PS_MIO24_501) A17(PS_MIO20_501) A19(PS_MIO16_501) A20(IO_L2N_T0_AD8N_35) B5(PS_MIO9_500) B9(PS_MIO51_501) B12(PS_MIO48_501) B13(PS_MIO50_501) B14(PS_MIO47_501) B15(PS_MIO45_501) B17(PS_MIO22_501) B18(PS_MIO18_501) B19(IO_L2P_T0_AD8P_35) B20(IO_L1N_T0_AD0N_35) C6(PS_MIO11_500) C10(PS_MIO52_501) C11(PS_MIO53_501) C12(PS_MIO49_501) C13(PS_MIO29_501) C15(PS_MIO30_501) C16(PS_MIO28_501) C17(PS_MIO41_501) C18(PS_MIO39_501) C20(IO_L1P_T0_AD0P_35) D5(PS_MIO8_500) D8(PS_MIO7_500) D10(PS_MIO19_501) D11(PS_MIO23_501) D13(PS_MIO27_501) D14(PS_MIO40_501) D15(PS_MIO33_501) D16(PS_MIO46_501) D18(IO_L3N_T0_DQS_AD1N_35) D19(IO_L4P_T0_35) D20(IO_L4N_T0_35) E6(PS_MIO0_500) E9(PS_MIO10_500) E12(PS_MIO42_501) E13(PS_MIO38_501) E14(PS_MIO17_501) E16(PS_MIO31_501) E17(IO_L3P_T0_DQS_AD1P_35) E18(IO_L5P_T0_AD9P_35) E19(IO_L5N_T0_AD9N_35) F12(PS_MIO35_501) F13(PS_MIO44_501) F14(PS_MIO21_501) F15(PS_MIO25_501) F16(IO_L6P_T0_35) F17(IO_L6N_T0_VREF_35) F19(IO_L15P_T2_DQS_AD12P_35) F20(IO_L15N_T2_DQS_AD12N_35) G14(IO_0_35) G15(IO_L19N_T3_VREF_35) G17(IO_L16P_T2_35) G18(IO_L16N_T2_35) G19(IO_L18P_T2_AD13P_35) G20(IO_L18N_T2_AD13N_35) H15(IO_L19P_T3_35) H16(IO_L13P_T2_MRCC_35) H17(IO_L13N_T2_MRCC_35) H18(IO_L14N_T2_AD4N_SRCC_35) H20(IO_L17N_T2_AD5N_35) J14(IO_L20N_T3_AD6N_35) J15(IO_25_35) J16(IO_L24N_T3_AD15N_35) J18(IO_L14P_T2_AD4P_SRCC_35) J19(IO_L10N_T1_AD11N_35) J20(IO_L17P_T2_AD5P_35) K9(VP_0) K14(IO_L20P_T3_AD6P_35) K16(IO_L24P_T3_AD15P_35) K17(IO_L12P_T1_MRCC_35) K18(IO_L12N_T1_MRCC_35) K19(IO_L10P_T1_AD11P_35) L10(VN_0) L14(IO_L22P_T3_AD7P_35) L15(IO_L22N_T3_AD7N_35) L16(IO_L11P_T1_SRCC_35) L17(IO_L11N_T1_SRCC_35) L19(IO_L9P_T1_DQS_AD3P_35) L20(IO_L9N_T1_DQS_AD3N_35) M14(IO_L23P_T3_35) M15(IO_L23N_T3_35) M17(IO_L8P_T1_AD10P_35) M18(IO_L8N_T1_AD10N_35) M19(IO_L7P_T1_AD2P_35) M20(IO_L7N_T1_AD2N_35) N15(IO_L21P_T3_DQS_AD14P_35) N16(IO_L21N_T3_DQS_AD14N_35) N17(IO_L23P_T3_34) N20(IO_L14P_T2_SRCC_34) P14(IO_L6P_T0_34) P15(IO_L24P_T3_34) P16(IO_L24N_T3_34) P18(IO_L23N_T3_34) P20(IO_L14N_T2_SRCC_34) R14(IO_L6N_T0_VREF_34) R16(IO_L19P_T3_34) R17(IO_L19N_T3_VREF_34) R18(IO_L20N_T3_34) R19(IO_0_34) T5(IO_L19P_T3_13) T9(IO_L12P_T1_MRCC_13) T10(IO_L1N_T0_34) T11(IO_L1P_T0_34) T12(IO_L2P_T0_34) T14(IO_L5P_T0_34) T15(IO_L5N_T0_34) T16(IO_L9P_T1_DQS_34) T17(IO_L20P_T3_34) T19(IO_25_34) T20(IO_L15P_T2_DQS_34) U5(IO_L19N_T3_VREF_13) U7(IO_L11P_T1_SRCC_13) U8(IO_L17N_T2_13) U9(IO_L17P_T2_13) U10(IO_L12N_T1_MRCC_13) U12(IO_L2N_T0_34) U13(IO_L3P_T0_DQS_PUDC_B_34) U14(IO_L11P_T1_SRCC_34) U15(IO_L11N_T1_SRCC_34) U17(IO_L9N_T1_DQS_34) U18(IO_L12P_T1_MRCC_34) U19(IO_L12N_T1_MRCC_34) U20(IO_L15N_T2_DQS_34) V5(IO_L6N_T0_VREF_13) V6(IO_L22P_T3_13) V7(IO_L11N_T1_SRCC_13) V8(IO_L15P_T2_DQS_13) V10(IO_L21N_T3_DQS_13) V11(IO_L21P_T3_DQS_13) V12(IO_L4P_T0_34) V13(IO_L3N_T0_DQS_34) V15(IO_L10P_T1_34) V16(IO_L18P_T2_34) V17(IO_L21P_T3_DQS_34) V18(IO_L21N_T3_DQS_34) V20(IO_L16P_T2_34) W6(IO_L22N_T3_13) W8(IO_L15N_T2_DQS_13) W9(IO_L16N_T2_13) W10(IO_L16P_T2_13) W11(IO_L18P_T2_13) W13(IO_L4N_T0_34) W14(IO_L8P_T1_34) W15(IO_L10N_T1_34) W16(IO_L18N_T2_34) W18(IO_L22P_T3_34) W19(IO_L22N_T3_34) W20(IO_L16N_T2_34) Y6(IO_L13N_T2_MRCC_13) Y7(IO_L13P_T2_MRCC_13) Y8(IO_L14N_T2_SRCC_13) Y9(IO_L14P_T2_SRCC_13) Y11(IO_L18N_T2_13) Y12(IO_L20P_T3_13) Y13(IO_L20N_T3_13) Y14(IO_L8N_T1_34) Y16(IO_L7P_T1_34) Y17(IO_L7N_T1_34) Y18(IO_L17P_T2_34) Y19(IO_L17N_T2_34); U7 J1(NC) J9(NC) L1(NC) L9(NC) M7(NC)

### Layout directives
differential pair: DDR_CK_n, DDR_CK_p, DDR_DQS0_n, DDR_DQS0_p, DDR_DQS1_n, DDR_DQS1_p, PLCLK_n, PLCLK_p

### Notes on the sheet
- ZYNQ 7010 NC区域
- NC
- (near U6) 重配置

### Library data of the parts
C26-C82 = 0402 100nF (104) 10% 16V: 贴片电容; ComponentLink1Description: 供应商链接; ComponentLink1URL: http://www.szlcsc.com/product/details_1877.html; Package: 0402; Supplier: LC; SuppliersPartNumber: C1525
D1 = 0805 红灯: 发光二极管; ComponentLink1Description: 供应商链接; ComponentLink1URL: http://www.szlcsc.com/product/details_2668.html; Package: 0805; Supplier: LC; SuppliersPartNumber: C2295
FB2 = 0805 100Ω 25% 100MHz: 贴片磁珠; ComponentLink1Description: 供应商链接; ComponentLink1URL: http://www.szlcsc.com/product/details_1367.html; Package: 0805; Supplier: LC; SuppliersPartNumber: C1015
R12 R13 R21 R22 = 0805 10KΩ (1002) 1%: 贴片电阻; ComponentLink1Description: 供应商链接; ComponentLink1URL: http://www.szlcsc.com/product/details_18102.html; Package: 0805; Supplier: LC; SuppliersPartNumber: C17414
R14 = 0402 33Ω (33R0) 1%: 贴片电阻; ComponentLink1Description: 供应商链接; ComponentLink1URL: http://www.szlcsc.com/product/details_25848.html; Package: 0402; Supplier: LC; SuppliersPartNumber: C25105
R15 R16 R24 = 0402 4.7KΩ (4701) 1%: 贴片电阻; ComponentLink1Description: 供应商链接; ComponentLink1URL: http://www.szlcsc.com/product/details_26643.html; Package: 0402; Supplier: LC; SuppliersPartNumber: C25900
R17 R18 = 0402 10KΩ (1002) 1%: 贴片电阻; ComponentLink1Description: 供应商链接; ComponentLink1URL: http://www.szlcsc.com/product/details_26487.html; Package: 0402; Supplier: LC; SuppliersPartNumber: C25744
R19 R20 = 0402 20KΩ (2002) 1%: 贴片电阻; ComponentLink1Description: 供应商链接; ComponentLink1URL: http://www.szlcsc.com/product/details_26508.html; Package: 0402; Supplier: LC; SuppliersPartNumber: C25765
R23 R25 = 0402 120Ω (1200) 1%: 贴片电阻; ComponentLink1Description: 供应商链接; ComponentLink1URL: http://www.szlcsc.com/product/details_25822.html; Package: 0402; Supplier: LC; SuppliersPartNumber: C25079
R26 = 0805 1.2KΩ (1201) 1%: 贴片电阻; ComponentLink1Description: 供应商链接; ComponentLink1URL: http://www.szlcsc.com/product/details_18067.html; Package: 0805; Supplier: LC; SuppliersPartNumber: C17379
R27 R28 = 0402 0Ω (0R0) 1%: 贴片电阻; ComponentLink1Description: 供应商链接; ComponentLink1URL: http://www.szlcsc.com/product/details_17853.html; Package: 0402; Supplier: LC; SuppliersPartNumber: C17168
S3 = SW DIP-2: DIP Switch, 2 Position, SPST; Published: 24-Mar-1999; LatestRevisionDate: 17-Jul-2002; LatestRevisionNote: Re-released for DXP Platform.; PackageReference: DIP-4; Publisher: Altium Limited
S4 = SW-PB: Switch; Published: 24-Mar-1999; LatestRevisionDate: 17-Jul-2002; LatestRevisionNote: Re-released for DXP Platform.; PackageReference: SPST-2; Publisher: Altium Limited; PackageDescription: Switch; 2 Leads
TP3-TP5 = test-point: 测试点
U5 = XC7Z020-2CLG400I: Manufacturer: XILINX(赛灵思); Convert to PCB: yes; Symbol: XC7Z020-2CLG400I; Device: XC7Z020-2CLG400I; Add into BOM: yes; Supplier: LCSC; Supplier Part: C569043; Supplier Footprint: CSPBGA-400; JLCPCB Part Class: 扩展库; LCSC Part Name: -; Datasheet: https://atta.szlcsc.com/upload/public/pdf/source/20191108/C446028_7ED8319F1F88212BA1E5D387DA4ECDB9.pdf; Manufacturer Part: XC7Z020-2CLG400I
U6 = VP811REUS/T: 复位电平管理芯片; Manufacturer: VP(中芯集成); Add into BOM: yes; ChipType: 电源监控器; Output Type: 开漏; Reset Active Level: 低电平有效; Number of Voltages Monitored: 1; Manual Reset: 有; Watchdog: 无; Symbol: VP811REUS/T; Device: VP811REUS/T; LCSC Part Name: VP811REUS/T; Supplier Part: C381485; Manufacturer Part: VP811REUS/T; Supplier Footprint: SOT-143; JLCPCB Part Class: Extended Part; Datasheet: https://atta.szlcsc.com/upload/public/pdf/source/20190322/C381486_AD49D5EAA1071F589CB38927003B9E48.pdf; Supplier: LCSC; Convert to PCB: yes; Operating Temperature: -40℃~+125℃@(Tj)
U7 = 4Gbit DDR3L BGA-96: Manufacturer: Nanya(南亚科技); Symbol: 4Gbt  DDR3L BGA-96; Add into BOM: yes; Device: 4Gbit DDR3L BGA-96; LCSC Part Name: NT5CC256M16ER-EK; Supplier Part: C428584; Manufacturer Part: NT5CC256M16ER-EK; Supplier Footprint: TFBGA-96; JLCPCB Part Class: 扩展库; Datasheet: https://atta.szlcsc.com/upload/public/pdf/source/20190912/C428584_C33860C5A34E1626944F37A05F9FF64A.pdf; Supplier: LCSC; Convert to PCB: yes
U8 = W25Q64: NOR FLASH

## Sheet jtag.SchDoc
size A4; SheetNumber: 4; SheetTotal: 7
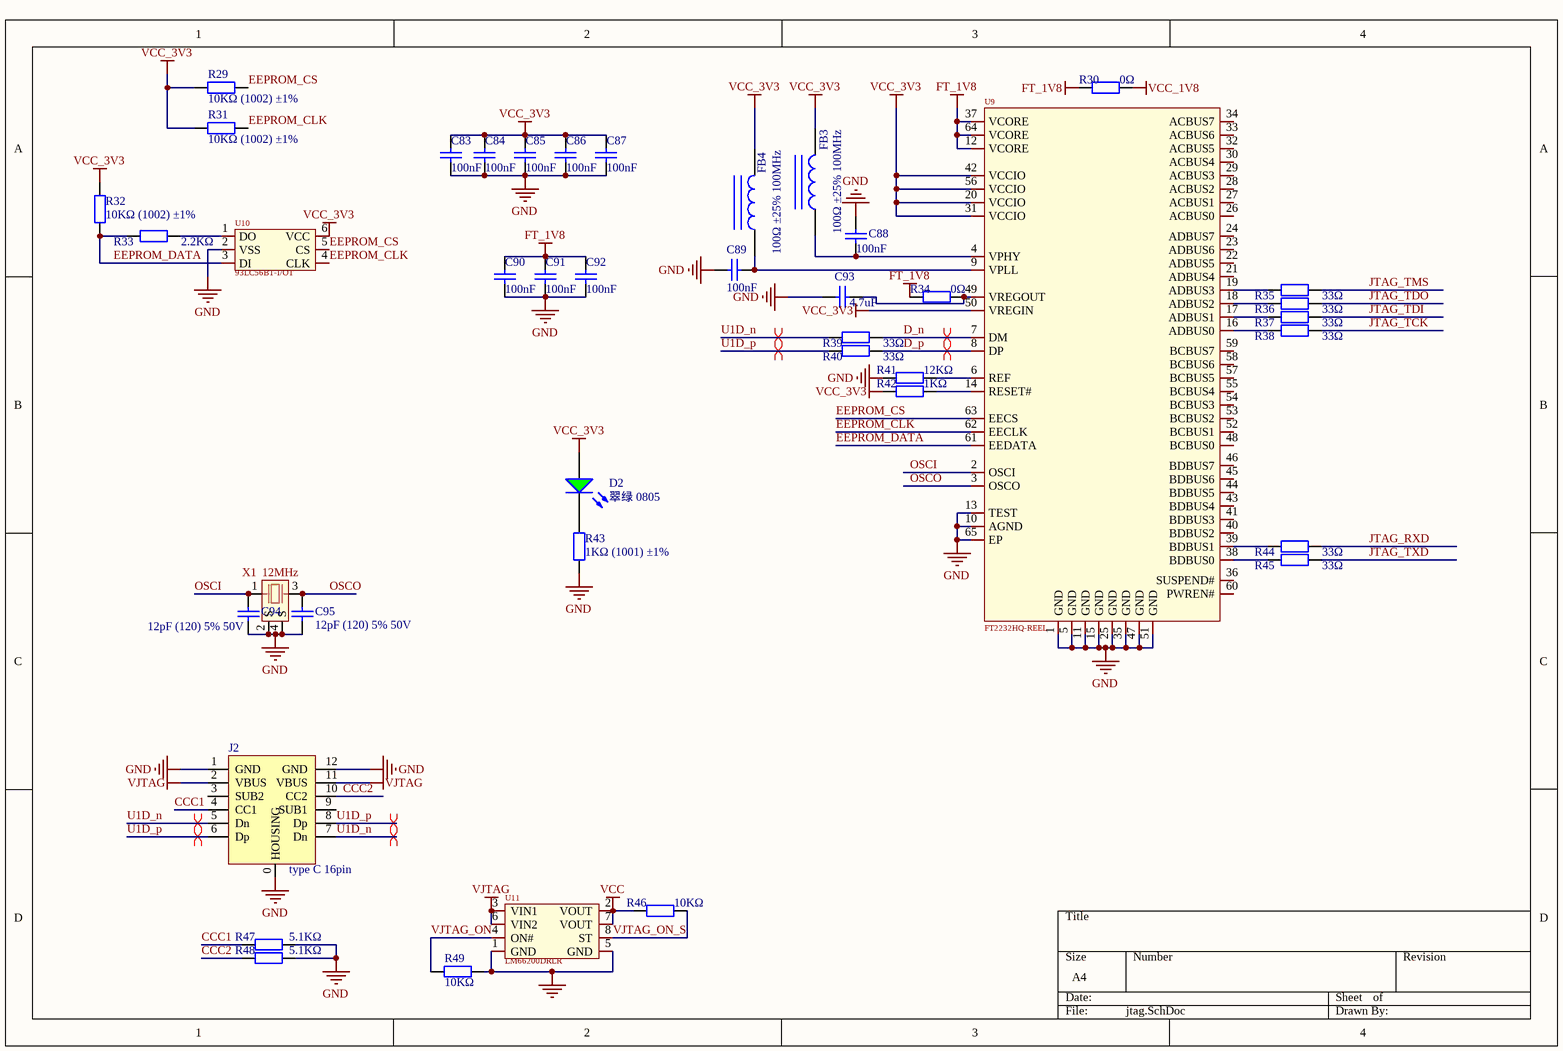
[diagram p4: jtag.SchDoc]

### Parts
C83  100nF  [0805_C]
C84  100nF  [0805_C]
C85  100nF  [0805_C]
C86  100nF  [0805_C]
C87  100nF  [0805_C]
C88  100nF  [0805_C]
C89  100nF  [0805_C]
C90  100nF  [0805_C]
C91  100nF  [0805_C]
C92  100nF  [0805_C]
C93  4.7uF  [0805_C]
C94  12pF (120) 5% 50V  [0805_C]
C95  12pF (120) 5% 50V  [0805_C]
D2  翠绿 0805  [0805_LED_S1]
FB3  100Ω ±25% 100MHz  [0805_L]
FB4  100Ω ±25% 100MHz  [0805_L]
J2  type C 16pin  [USB type C  16pin]
R29  10KΩ (1002) ±1%  [0805_R]
R30  0Ω  [0402_R]
R31  10KΩ (1002) ±1%  [0805_R]
R32  10KΩ (1002) ±1%  [0805_R]
R33  2.2KΩ  [0805_R]
R34  0Ω  [0402_R]
R35  33Ω  [0402_R]
R36  33Ω  [0402_R]
R37  33Ω  [0402_R]
R38  33Ω  [0402_R]
R39  33Ω  [0402_R]
R40  33Ω  [0402_R]
R41  12KΩ  [0805_R]
R42  1KΩ  [0805_R]
R43  1KΩ (1001) ±1%  [0805_R]
R44  33Ω  [0402_R]
R45  33Ω  [0402_R]
R46  10KΩ  [0805_R]
R47  5.1KΩ  [0805_R]
R48  5.1KΩ  [0805_R]
R49  10KΩ  [0805_R]
U9  FT2232HQ-REEL  [QFN-64_L9.0-W9.0-P0.50-TL-EP4.3]
U10  93LC56BT-I/OT  [SOT-23-6_L2.9-W1.6-P0.95-LS2.8-BR]
U11  LM66200DRLR  [SOT-583-8_L2.1-W1.2-P0.50-LS1.6-BL]
X1  12MHz  [3225]

### Nets
FT_1V8: C90.2 C91.2 C92.2 R30.1 R34.1 U9.12(VCORE) U9.37(VCORE) U9.64(VCORE)
GND: C83.1 C84.1 C85.1 C86.1 C87.1 C88.2 C89.2 C90.1 C91.1 C92.1 C93.1 C94.1 C95.1 J2.0(HOUSING) J2.1(GND) J2.12(GND) R41.1 R43.1 R47.2 R48.2 R49.1 U9.1(GND) U9.5(GND) U9.10(AGND) U9.11(GND) U9.13(TEST) U9.15(GND) U9.25(GND) U9.35(GND) U9.47(GND) U9.51(GND) U9.65(EP) U10.2(VSS) U11.1(GND) U11.5(GND) X1.2(S) X1.4(S)
VCC: R46.1 U11.2(VOUT) U11.7(VOUT)
VCC_1V8: R30.2
VCC_3V3: C83.2 C84.2 C85.2 C86.2 C87.2 D2.A FB3.2 FB4.2 R29.2 R31.2 R32.2 R42.1 U9.20(VCCIO) U9.31(VCCIO) U9.42(VCCIO) U9.50(VREGIN) U9.56(VCCIO) U10.6(VCC)
VJTAG: J2.2(VBUS) J2.11(VBUS) U11.3(VIN1) U11.6(VIN2)
CCC1: J2.4(CC1) R47.1
CCC2: J2.10(CC2) R48.1
D_n: R39.2 U9.7(DM)
D_p: R40.2 U9.8(DP)
EEPROM_CLK: R31.1 U9.62(EECLK) U10.4(CLK)
EEPROM_CS: R29.1 U9.63(EECS) U10.5(CS)
EEPROM_DATA: R32.1 R33.1 U9.61(EEDATA) U10.3(DI)
JTAG_RXD: R44.2
JTAG_TCK: R38.2
JTAG_TDI: R37.2
JTAG_TDO: R36.2
JTAG_TMS: R35.2
JTAG_TXD: R45.2
OSCI: C94.2 U9.2(OSCI) X1.1
OSCO: C95.2 U9.3(OSCO) X1.3
U1D_n: J2.5(Dn) J2.7(Dn) R39.1
U1D_p: J2.6(Dp) J2.8(Dp) R40.1
VJTAG_ON: R49.2 U11.4(ON#)
VJTAG_ON_S: R46.2 U11.8(ST)
NetC88_1: C88.1 FB3.1 U9.4(VPHY)
NetC89_1: C89.1 FB4.1 U9.9(VPLL)
NetC93_2: C93.2 R34.2 U9.49(VREGOUT)
NetD2_K: D2.K R43.2
NetR33_2: R33.2 U10.1(DO)
NetR35_1: R35.1 U9.19(ADBUS3)
NetR36_1: R36.1 U9.18(ADBUS2)
NetR37_1: R37.1 U9.17(ADBUS1)
NetR38_1: R38.1 U9.16(ADBUS0)
NetR41_2: R41.2 U9.6(REF)
NetR42_2: R42.2 U9.14(RESET#)
NetR44_1: R44.1 U9.39(BDBUS1)
NetR45_1: R45.1 U9.38(BDBUS0)

Not connected (* = marked no-connect by the designer): J2 3(SUB2) 9(SUB1); U9 21(ADBUS4) 22(ADBUS5) 23(ADBUS6) 24(ADBUS7) 26(ACBUS0) 27(ACBUS1) 28(ACBUS2) 29(ACBUS3) 30(ACBUS4) 32(ACBUS5) 33(ACBUS6) 34(ACBUS7) 36(SUSPEND#) 40(BDBUS2) 41(BDBUS3) 43(BDBUS4) 44(BDBUS5) 45(BDBUS6) 46(BDBUS7) 48(BCBUS0) 52(BCBUS1) 53(BCBUS2) 54(BCBUS3) 55(BCBUS4) 57(BCBUS5) 58(BCBUS6) 59(BCBUS7) 60(PWREN#)

### Layout directives
differential pair: D_n, D_p, U1D_n, U1D_p

### Library data of the parts
C83-C92 = 0805 100nF(104) 10% 50V: 贴片电容; ComponentLink1Description: 供应商链接; ComponentLink1URL: http://www.szlcsc.com/product/details_50686.html; Package: 0805; Supplier: LC; SuppliersPartNumber: C49678
C93 = 0805 4.7uF (475) 10% 25V: 贴片电容; ComponentLink1Description: 供应商链接; ComponentLink1URL: http://www.szlcsc.com/product/details_2131.html; Package: 0805; Supplier: LC; SuppliersPartNumber: C1779
C94 C95 = 0805 12pF (120) 5% 50V: 贴片电容; ComponentLink1Description: 供应商链接; ComponentLink1URL: http://www.szlcsc.com/product/details_2144.html; Package: 0805; Supplier: LC; SuppliersPartNumber: C1792
D2 = 0805 翠绿: 发光二极管; ComponentLink1Description: 供应商链接; ComponentLink1URL: http://www.szlcsc.com/product/details_2670.html; Package: 0805; Supplier: LC; SuppliersPartNumber: C2297
FB3 FB4 = 0805 100Ω 25% 100MHz: 贴片磁珠; ComponentLink1Description: 供应商链接; ComponentLink1URL: http://www.szlcsc.com/product/details_1367.html; Package: 0805; Supplier: LC; SuppliersPartNumber: C1015
J2 = USB type C 16pin: 16针脚C口
R29 R31 R32 R46 R49 = 0805 10KΩ (1002) 1%: 贴片电阻; ComponentLink1Description: 供应商链接; ComponentLink1URL: http://www.szlcsc.com/product/details_18102.html; Package: 0805; Supplier: LC; SuppliersPartNumber: C17414
R30 R34 = 0402 0Ω (0R0) 1%: 贴片电阻; ComponentLink1Description: 供应商链接; ComponentLink1URL: http://www.szlcsc.com/product/details_17853.html; Package: 0402; Supplier: LC; SuppliersPartNumber: C17168
R33 = 0805 2.2KΩ (2201) 1%: 贴片电阻; ComponentLink1Description: 供应商链接; ComponentLink1URL: http://www.szlcsc.com/product/details_18208.html; Package: 0805; Supplier: LC; SuppliersPartNumber: C17520
R35-R40 R44 R45 = 0805 33Ω (33R0) 1%: 贴片电阻; ComponentLink1Description: 供应商链接; ComponentLink1URL: http://www.szlcsc.com/product/details_18322.html; Package: 0805; Supplier: LC; SuppliersPartNumber: C17634
R41 = 0805 12KΩ (1202) 1%: 贴片电阻; ComponentLink1Description: 供应商链接; ComponentLink1URL: http://www.szlcsc.com/product/details_18132.html; Package: 0805; Supplier: LC; SuppliersPartNumber: C17444
R42 R43 = 0805 1KΩ (1001) 1%: 贴片电阻; ComponentLink1Description: 供应商链接; ComponentLink1URL: http://www.szlcsc.com/product/details_18201.html; Package: 0805; Supplier: LC; SuppliersPartNumber: C17513
R47 R48 = 0402 5.1KΩ (5101) 1%: 贴片电阻; ComponentLink1Description: 供应商链接; ComponentLink1URL: http://www.szlcsc.com/product/details_26648.html; Package: 0402; Supplier: LC; SuppliersPartNumber: C25905
U9 = FT2232HQ-REEL: Manufacturer: FTDI(飞特帝亚); Add into BOM: yes; Applications Function: USB转UART；USB转FIFO; Supply Voltage: 3V~3.6V; Symbol: FT2232HQ-REEL; Device: FT2232HQ-REEL; LCSC Part Name: FT2232H 双高速 USB 转多用途 UART/FIFO IC; Supplier Part: C193662; Manufacturer Part: FT2232HQ-REEL; Supplier Footprint: QFN-64-EP(9x9); JLCPCB Part Class: Extended Part; Datasheet: https://atta.szlcsc.com/upload/public/pdf/source/20180530/C193662_F14B45A4B5271BE746E436B0F2E041EE.pdf; Supplier: LCSC; Convert to PCB: yes; Protocol: -; Operating Temperature: -40℃~+85℃
U10 = 93LC56BT-I/OT: Manufacturer: MICROCHIP(美国微芯); Add into BOM: yes; Interface Type: SPI; Memory Size: 2Kbit; Supply Voltage: 2.5V~5.5V; Write Cycle Time (Tw): 6ms; Data Retention - TDR (Year): 200年; Write Cycle Endurance: 1000000次; Symbol: 93LC56BT-I/OT; Device: 93LC56BT-I/OT; LCSC Part Name: 93LC56BT-I/OT; Supplier Part: C190271; Manufacturer Part: 93LC56BT-I/OT; Supplier Footprint: SOT-23-6; JLCPCB Part Class: Extended Part; Datasheet: https://atta.szlcsc.com/upload/public/pdf/source/20140724/1457707164359.pdf; Supplier: LCSC; Convert to PCB: yes; Operating Temperature: -40℃~+85℃
U11 = LM66200DRLR: as U3 on sheet Cortex_M; Symbol: LM66200DRLR; Device: LM66200DRLR; LCSC Part Name: LM66200DRLR; Supplier Part: C3235556; Manufacturer Part: LM66200DRLR; Supplier Footprint: SOT-583; JLCPCB Part Class: Extended Part; Datasheet: https://www.ti.com/cn/lit/gpn/lm66200; Supplier: LCSC; Convert to PCB: yes
X1 = 四脚无源晶体: 4脚贴片无源晶体; Manufacturer: YJX(雅晶鑫); Symbol: TAXM8M4RDBCCT2T; Add into BOM: yes; Value: 8MHz; Normal temperature Frequency Tolerance: ±10ppm; Load Capacitance: 10pF; Frequency Stability: ±15ppm; Equivalent Series Resistance(ESR): 250Ω; Device: TAXM8M4RDBCCT2T; LCSC Part Name: 8MHz ±10ppm 10pF; Supplier Part: C400090; Manufacturer Part: TAXM8M4RDBCCT2T; Supplier Footprint: SMD3225-4P; JLCPCB Part Class: Extended Part; Datasheet: https://atta.szlcsc.com/upload/public/pdf/source/20190626/C400090_CF95B89E745AFE4EF2E392EF8AC009D6.pdf; Supplier: LCSC; Convert to PCB: yes; Type: 贴片晶振; Operating Temperature: -40℃~+85℃